# Altium project USV-Central Controller Board.PrjPcb (part 1 of 2)
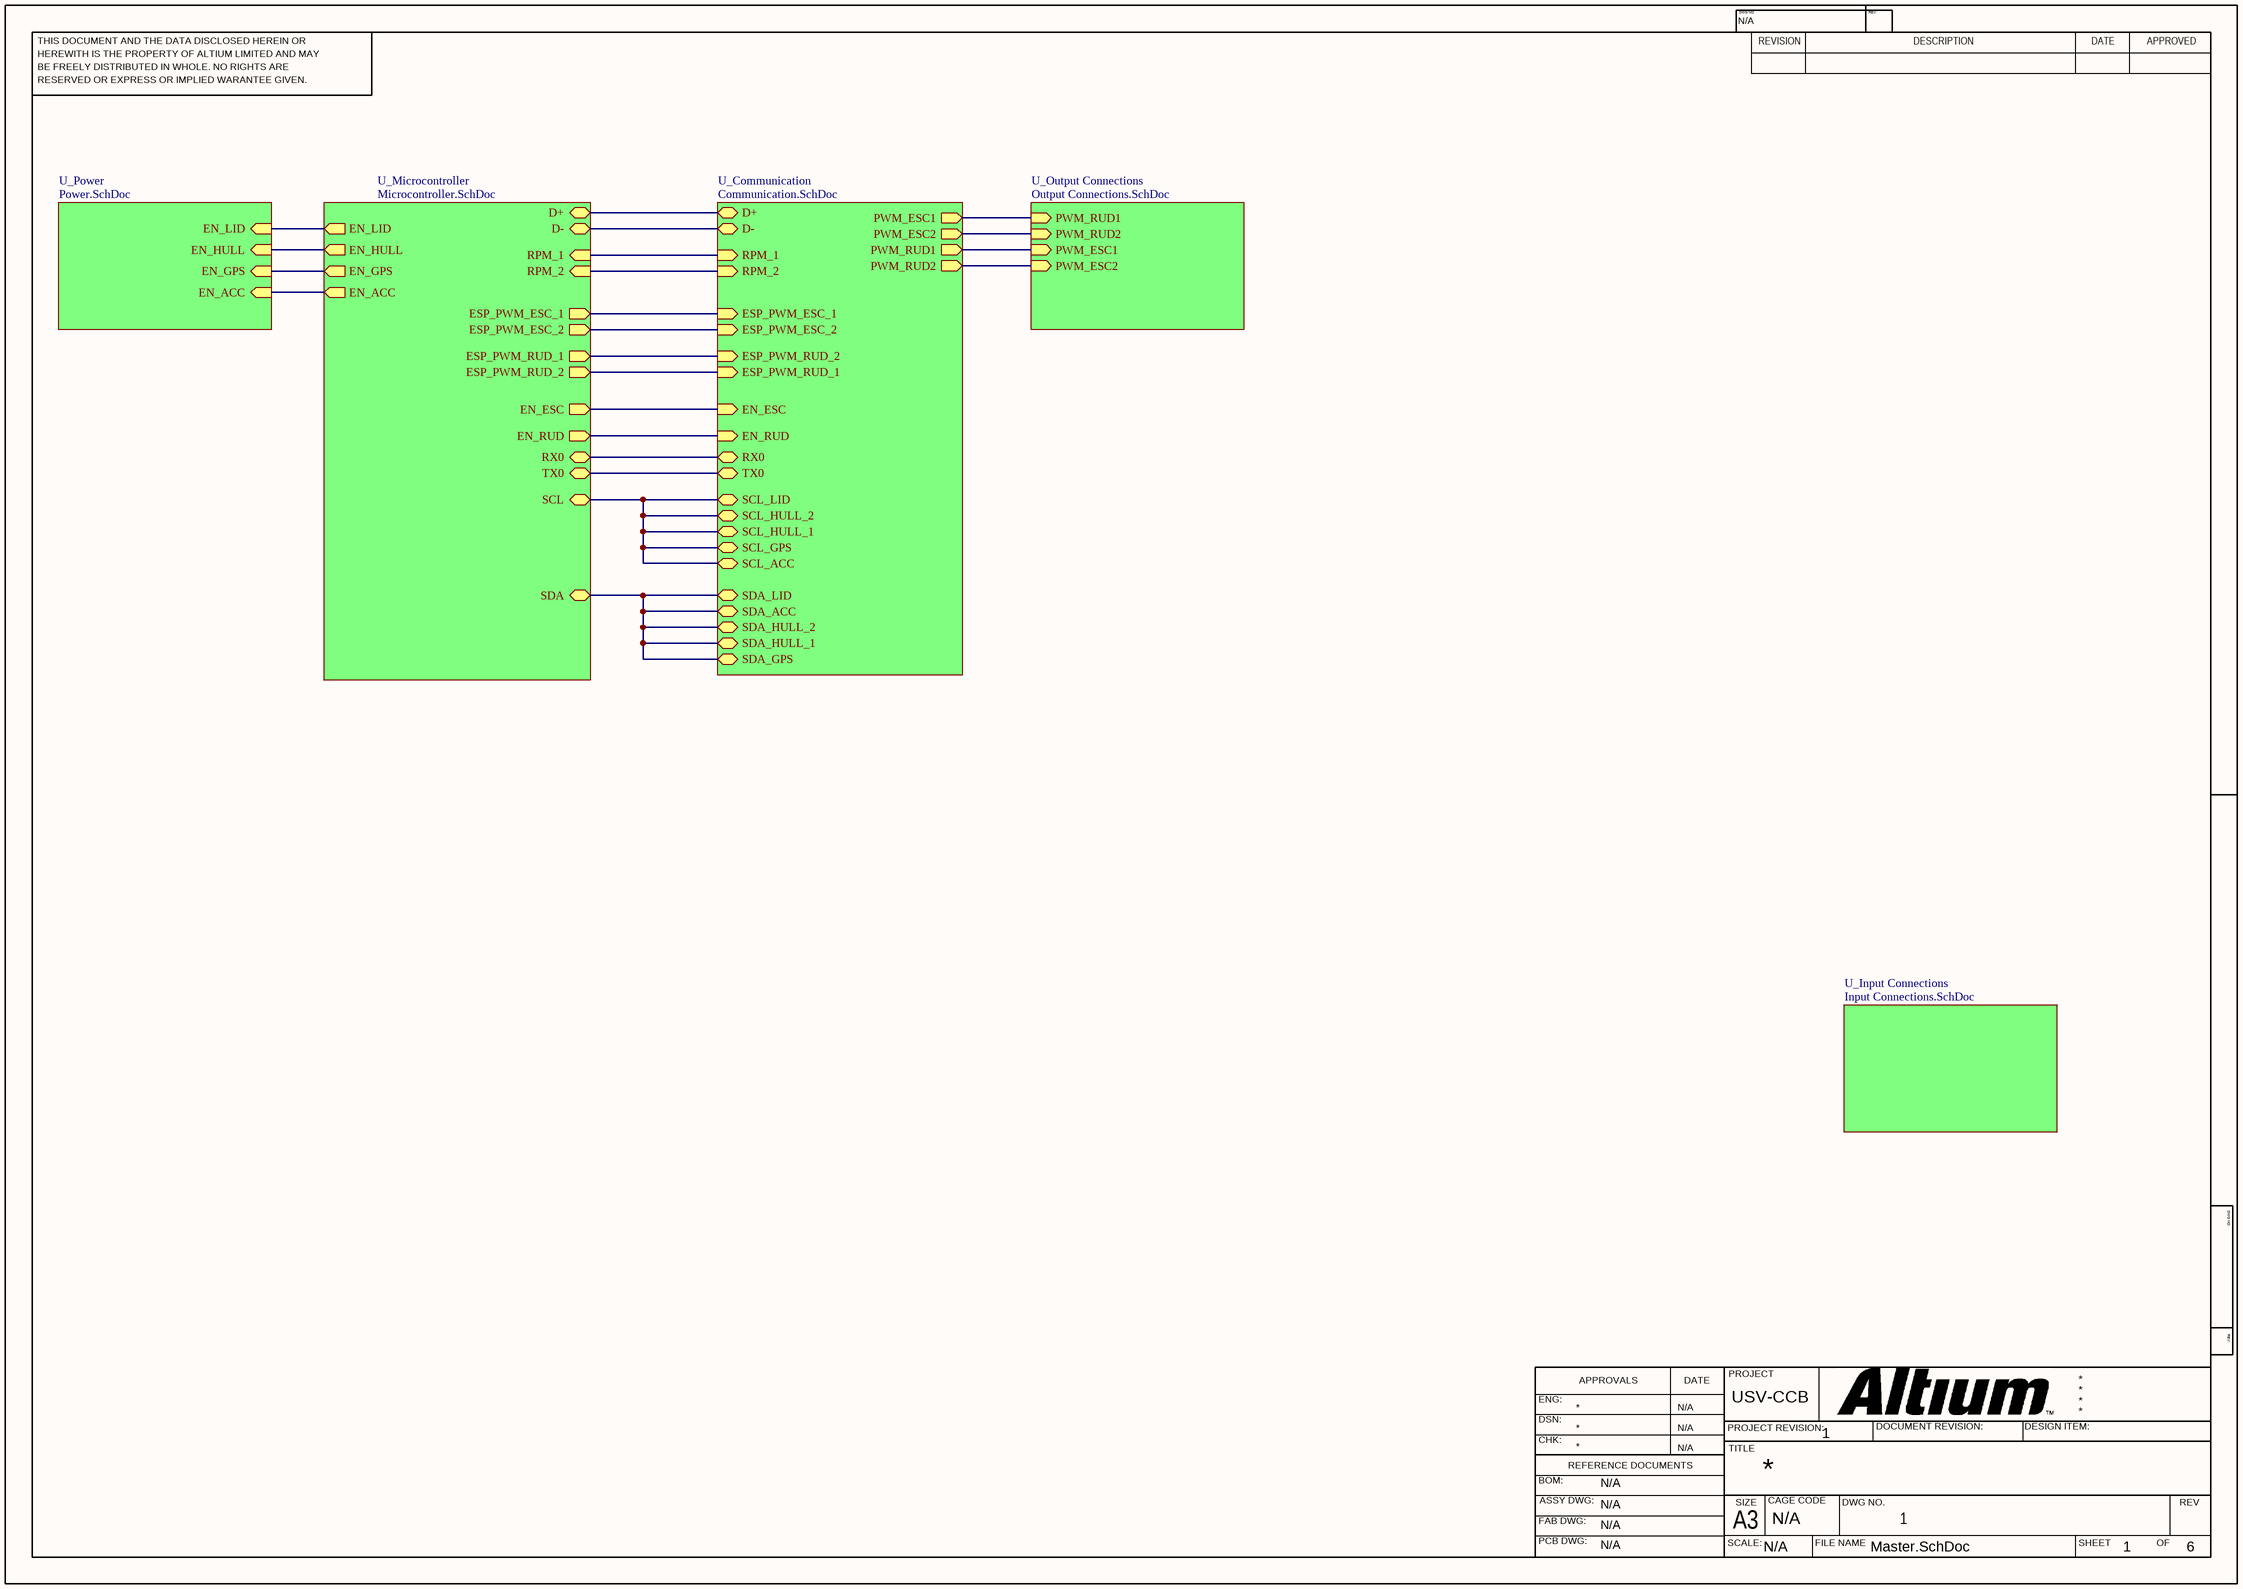
[diagram p0: Master.SchDoc]
CAGE_CODE: N/A; CHK_APP_DATE: N/A; DOC_NO_ASSY: 1; DOC_NO_ASSY_DWG: N/A; DOC_NO_BOM: N/A; DOC_NO_FAB_DWG: N/A; DOC_NO_SCH_DWG: 1; DSN_APP_DATE: N/A; ENG_APP_DATE: N/A; PCB_DWG_NO: N/A; Project: USV-CCB; SCH_SCALE: N/A; VersionControl_ProjFolderRevNumber: 1
6 sheets, 100 parts. Net scope: hierarchical (ports join the sheet entries above them; power ports are global).
Board file: USV-Central Controller Board.PcbDoc
Sheets:
  Master.SchDoc
    U_Power = Power.SchDoc
    U_Microcontroller = Microcontroller.SchDoc
    U_Input Connections = Input Connections.SchDoc
    U_Communication = Communication.SchDoc
    U_Output Connections = Output Connections.SchDoc

## Sheet Master.SchDoc
size 420 x 297 mm; SheetNumber: 1; SheetTotal: 6

### Sub-sheets
U_Communication = Communication.SchDoc: SDA_LID (bidir), RPM_1 (in), SCL_ACC (bidir), SDA_ACC (bidir), SCL_GPS (bidir), SDA_HULL_2 (bidir), SCL_HULL_2 (bidir), RPM_2 (in), SCL_HULL_1 (bidir), SDA_HULL_1 (bidir), SCL_LID (bidir), SDA_GPS (bidir), PWM_ESC1 (out), EN_ESC (in), ESP_PWM_ESC_1 (in), PWM_ESC2 (out), ESP_PWM_ESC_2 (in), PWM_RUD1 (out), ESP_PWM_RUD_1 (in), PWM_RUD2 (out), ESP_PWM_RUD_2 (in), EN_RUD (in), D+ (bidir), D- (bidir), RX0 (bidir), TX0 (bidir)
U_Input Connections = Input Connections.SchDoc: no entries
U_Microcontroller = Microcontroller.SchDoc: SDA (bidir), SCL (bidir), RPM_1 (in), RPM_2 (in), ESP_PWM_RUD_1 (out), ESP_PWM_RUD_2 (out), ESP_PWM_ESC_1 (out), ESP_PWM_ESC_2 (out), EN_LID (out), EN_HULL (out), EN_GPS (out), EN_ACC (out), EN_ESC (out), EN_RUD (out), D- (bidir), D+ (bidir), TX0 (bidir), RX0 (bidir)
U_Output Connections = Output Connections.SchDoc: PWM_RUD1 (in), PWM_RUD2 (in), PWM_ESC1 (in), PWM_ESC2 (in)
U_Power = Power.SchDoc: EN_LID (in), EN_HULL (in), EN_GPS (in), EN_ACC (in)

### Nets
D_N: sheet U_Microcontroller/D-, sheet U_Communication/D-
D_P: sheet U_Microcontroller/D+, sheet U_Communication/D+
RX0: sheet U_Microcontroller/RX0, sheet U_Communication/RX0
TX0: sheet U_Microcontroller/TX0, sheet U_Communication/TX0
NetC24_1: sheet U_Microcontroller/EN_RUD, sheet U_Communication/EN_RUD
NetC28_1: sheet U_Microcontroller/EN_ESC, sheet U_Communication/EN_ESC
NetJ2_2: sheet U_Communication/PWM_ESC1, sheet U_Output Connections/PWM_RUD1
NetJ3_2: sheet U_Communication/PWM_RUD1, sheet U_Output Connections/PWM_ESC1
NetJ4_2: sheet U_Communication/PWM_ESC2, sheet U_Output Connections/PWM_RUD2
NetJ5_2: sheet U_Communication/PWM_RUD2, sheet U_Output Connections/PWM_ESC2
NetK1_10: sheet U_Microcontroller/ESP_PWM_RUD_1, sheet U_Communication/ESP_PWM_RUD_2
NetK2_10: sheet U_Microcontroller/ESP_PWM_ESC_2, sheet U_Communication/ESP_PWM_ESC_2
NetK3_10: sheet U_Microcontroller/ESP_PWM_RUD_2, sheet U_Communication/ESP_PWM_RUD_1
NetK4_10: sheet U_Microcontroller/ESP_PWM_ESC_1, sheet U_Communication/ESP_PWM_ESC_1
NetMD1_10: sheet U_Power/EN_HULL, sheet U_Microcontroller/EN_HULL
NetMD1_11: sheet U_Power/EN_GPS, sheet U_Microcontroller/EN_GPS
NetMD1_12: sheet U_Power/EN_ACC, sheet U_Microcontroller/EN_ACC
NetMD1_24: sheet U_Microcontroller/RPM_1, sheet U_Communication/RPM_1
NetMD1_26: sheet U_Microcontroller/RPM_2, sheet U_Communication/RPM_2
NetMD1_33: sheet U_Microcontroller/SDA, sheet U_Communication/SDA_LID, sheet U_Communication/SDA_ACC, sheet U_Communication/SDA_HULL_2, sheet U_Communication/SDA_HULL_1, sheet U_Communication/SDA_GPS
NetMD1_36: sheet U_Microcontroller/SCL, sheet U_Communication/SCL_ACC, sheet U_Communication/SCL_GPS, sheet U_Communication/SCL_HULL_2, sheet U_Communication/SCL_HULL_1, sheet U_Communication/SCL_LID
NetMD1_37: sheet U_Power/EN_LID, sheet U_Microcontroller/EN_LID

### Notes on the sheet
- THIS DOCUMENT AND THE DATA DISCLOSED HEREIN OR
- HEREWITH IS THE PROPERTY OF ALTIUM LIMITED AND MAY
- DWG NO:
- REVISION
- REV:
- DESCRIPTION
- DATE
- APPROVED
- BE FREELY DISTRIBUTED IN WHOLE. NO RIGHTS ARE
- RESERVED OR EXPRESS OR IMPLIED WARANTEE GIVEN.
- ENG:
- APPROVALS
- PROJECT
- DSN:
- CHK:
- REFERENCE DOCUMENTS
- PROJECT REVISION:
- TITLE
- DOCUMENT REVISION:
- DESIGN ITEM:
- BOM:
- FAB DWG:
- PCB DWG:
- ASSY DWG:
- SCALE:
- A3
- SIZE
- CAGE CODE
- FILE NAME
- DWG NO.
- SHEET
- OF
- REV

## Sheet Power.SchDoc
size 420 x 297 mm; SheetNumber: 2; SheetTotal: 6; SPICEModelCacheKNAGYUHY: <root> / <DocumentId>KNAGYUHY</DocumentId> / </root>
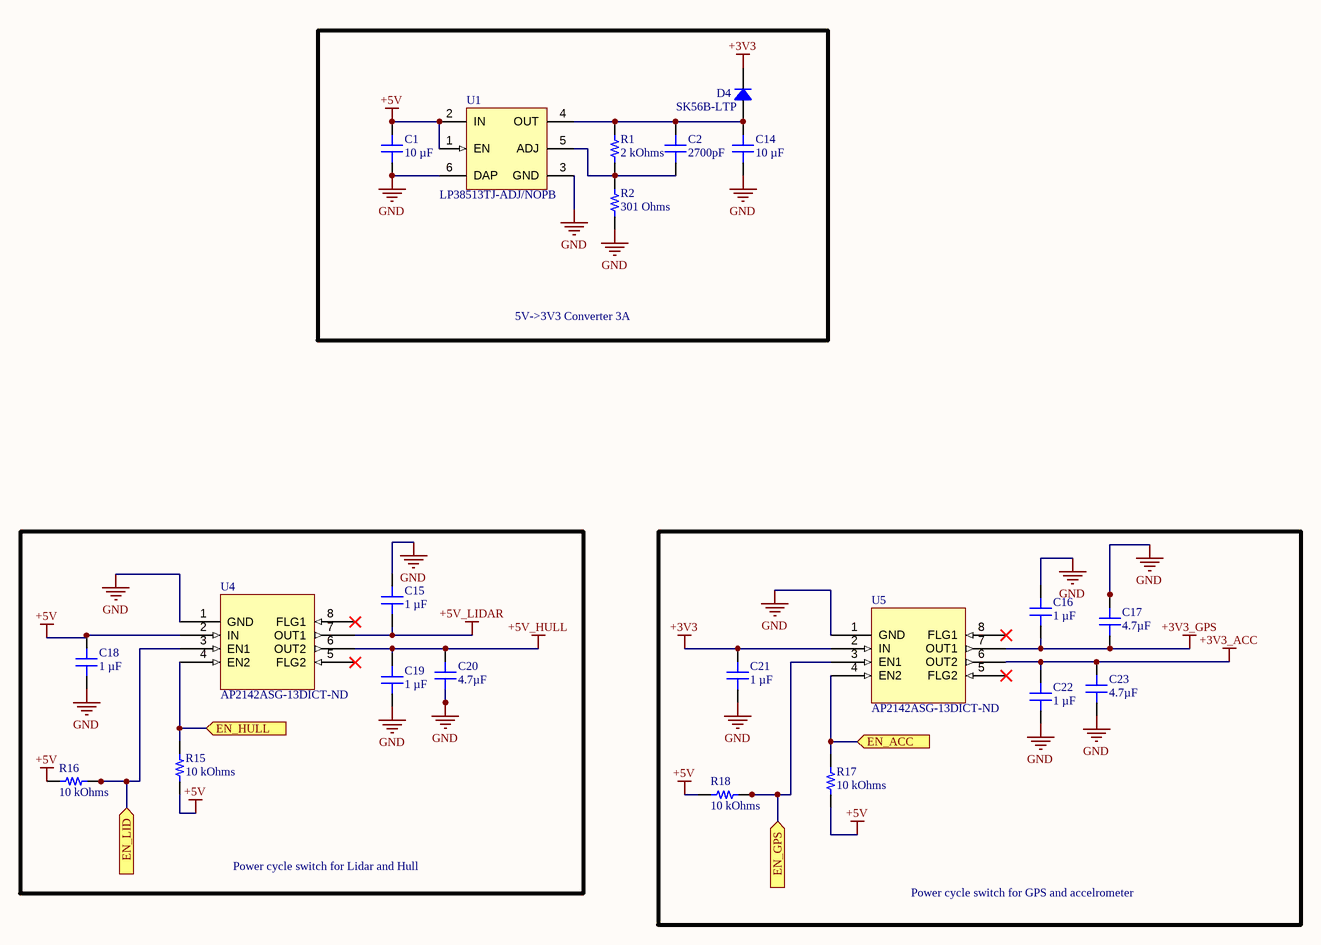
[diagram p1: Power.SchDoc]

### Parts
C1  10 µF  [CAP 0805_2012]
C2  2700pF  [CAP 0603_1608]
C14  10 µF  [CAP 0805_2012]
C15  1 µF  [CAP 0603_1608]
C16  1 µF  [CAP 0603_1608]
C17  4.7µF  [CAP 0805_2012]
C18  1 µF  [CAP 0603_1608]
C19  1 µF  [CAP 0603_1608]
C20  4.7µF  [CAP 0805_2012]
C21  1 µF  [CAP 0603_1608]
C22  1 µF  [CAP 0603_1608]
C23  4.7µF  [CAP 0805_2012]
D4  SK56B-LTP  [DO214AA SMB]
R1  2 kOhms  [RES 0603_1608]
R2  301 Ohms  [RES 0603_1608]
R15  10 kOhms  [RES 0603_1608]
R16  10 kOhms  [RES 0603_1608]
R17  10 kOhms  [RES 0603_1608]
R18  10 kOhms  [RES 0603_1608]
U1  LP38513TJ-ADJ/NOPB  [NDQ0005A_M]
U4  AP2142ASG-13DICT-ND  [SOP127P600X175-8N]
U5  AP2142ASG-13DICT-ND  [SOP127P600X175-8N]

### Blocks framed on the sheet
5V->3V3 Converter 3A: C1 C2 C14 D4 R1 R2 U1
Power cycle switch for Lidar and Hull: C15 C18-C20 R15 R16 U4
Power cycle switch for GPS and accelrometer: C16 C17 C21-C23 R17 R18 U5

### Ports
EN_ACC (in), EN_GPS (in), EN_HULL (in), EN_LID (in)

### Nets
+3V3: C21.1 D4.2 U5.2(IN)
+3V3_ACC: C22.2 C23.2 U5.6(OUT2)
+3V3_GPS: C16.1 C17.2 U5.7(OUT1)
+5V: C1.2 C18.1 R15.2 R16.2 R17.2 R18.2 U1.1(EN) U1.2(IN) U4.2(IN)
+5V_HULL: C19.2 C20.2 U4.6(OUT2)
+5V_LIDAR: C15.1 U4.7(OUT1)
GND: C1.1 C14.1 C15.2 C16.2 C17.1 C18.2 C19.1 C20.1 C21.2 C22.1 C23.1 R2.1 U1.3(GND) U1.6(DAP) U4.1(GND) U5.1(GND)
NetC2_1: C2.1 R1.1 R2.2 U1.5(ADJ)
NetC2_2: C2.2 C14.2 D4.1 R1.2 U1.4(OUT)
NetMD1_10: R15.1 U4.4(EN2) ; port EN_HULL
NetMD1_11: R18.1 U5.3(EN1) ; port EN_GPS
NetMD1_12: R17.1 U5.4(EN2) ; port EN_ACC
NetMD1_37: R16.1 U4.3(EN1) ; port EN_LID

Not connected (* = marked no-connect by the designer): U4 5(FLG2)* 8(FLG1)*; U5 5(FLG2)* 8(FLG1)*

### Notes on the sheet
- THIS DOCUMENT AND THE DATA DISCLOSED HEREIN OR
- HEREWITH IS THE PROPERTY OF ALTIUM LIMITED AND MAY
- DWG NO:
- REVISION
- REV:
- DESCRIPTION
- DATE
- APPROVED
- BE FREELY DISTRIBUTED IN WHOLE. NO RIGHTS ARE
- RESERVED OR EXPRESS OR IMPLIED WARANTEE GIVEN.
- ENG:
- APPROVALS
- PROJECT
- DSN:
- CHK:
- REFERENCE DOCUMENTS
- PROJECT REVISION:
- TITLE
- DOCUMENT REVISION:
- DESIGN ITEM:
- BOM:
- FAB DWG:
- PCB DWG:
- ASSY DWG:
- SCALE:
- A3
- SIZE
- CAGE CODE
- FILE NAME
- DWG NO.
- SHEET
- OF
- REV

### Library data of the parts
C1 C14 = CGA4J1X5R1C106K125AC: CAP CER 10UF 16V X5R 0805; manufacturer: TDK Corporation; Tolerance: ±10%; Part Number: CGA4J1X5R1C106K125AC; Value: 10 µF; Applications: Automotive; Capacitance: 10 µF; componentlink1description: Datasheet; componentlink1url: https://product.tdk.com/info/en/catalog/datasheets/mlcc_automotive_general_en.pdf?ref_disty=digikey; componentlink2description: DigiKey Link; componentlink2url: https://www.digikey.com/en/products/detail/tdk-corporation/CGA4J1X5R1C106K125AC/2781309; Device Package: 0805 (2012 Metric); lastupdated: 2022-04-02 5:58:40 AM; Lifecycle Status: Active; Minimum Order: 1; Mounting Type: Surface Mount, MLCC; Operating Temperature: -55°C ~ 85°C; Package / Case: 0805 (2012 Metric); packaging: TapeAndReel; partid: 3076; Part Status: Active; price: 0.09; Ratings: AEC-Q200; series: CGA; Size / Dimension: 0.079" L x 0.049" W (2.00mm x 1.25mm); Supplier 1: DigiKey; Supplier Part Number 1: 445-7883-1-ND; Temperature Coefficient: X5R; Thickness (Max): 0.057" (1.45mm); Voltage - Rated: 16V
C2 = 06035C272KAT2A: CAP CER 2700PF 50V X7R 0603; manufacturer: AVX Corporation; Tolerance: ±10%; Part Number: 06035C272KAT2A; Value: 2700pF; Applications: General Purpose; Capacitance: 2700pF; componentlink1description: Datasheet; componentlink1url: http://datasheets.avx.com/X7RDielectric.pdf; componentlink2description: DigiKey Link; componentlink2url: http://digikey.com/product-detail/en/avx-corporation/06035C272KAT2A/478-1220-1-ND/564252; Device Package: 0603 (1608 Metric); lastupdated: 2020-09-02 1:03:32 AM; Lifecycle Status: Active; Minimum Order: 1; Mounting Type: Surface Mount, MLCC; Operating Temperature: -55°C ~ 125°C; Package / Case: 0603 (1608 Metric); packaging: TapeAndReel; partid: 4337; Part Status: Active; price: 0.02; series: -; Size / Dimension: 0.063" L x 0.032" W (1.60mm x 0.81mm); Supplier 1: DigiKey; Supplier Part Number 1: 478-1220-1-ND; Temperature Coefficient: X7R; Thickness (Max): 0.035" (0.90mm); Voltage - Rated: 50V
C15 C16 C18 C19 C21 C22 = CM105X7R105K16ATH: CAP CER 1UF 16V X7R 0603; manufacturer: KYOCERA AVX; Tolerance: ±10%; Part Number: CM105X7R105K16ATH; Value: 1 µF; Applications: General Purpose; Capacitance: 1 µF; componentlink1description: Datasheet; componentlink1url: https://ele.kyocera.com/assets/products/capacitor/CM_Series_e.pdf; componentlink2description: DigiKey Link; componentlink2url: https://www.digikey.com/en/products/detail/kyocera-avx/CM105X7R105K16ATH/10197120; Device Package: 0603 (1608 Metric); lastupdated: 2022-03-07 3:17:15 PM; Lifecycle Status: Active; Minimum Order: 1; Mounting Type: Surface Mount, MLCC; Operating Temperature: -55°C ~ 125°C; Package / Case: 0603 (1608 Metric); packaging: TapeAndReel; partid: 34778; Part Status: Active; price: 0.03; series: CM; Size / Dimension: 0.063" L x 0.031" W (1.60mm x 0.80mm); Supplier 1: DigiKey; Supplier Part Number 1: 478-CM105X7R105K16ATHCT-ND; Temperature Coefficient: X7R; Thickness (Max): 0.035" (0.90mm); Voltage - Rated: 16V
C17 C20 C23 = 0805ZC475MAT2A: CAP CER 4.7UF 10V X7R 0805; manufacturer: AVX Corporation; Tolerance: ±20%; Part Number: 0805ZC475MAT2A; Value: 4.7µF; Applications: General Purpose; Capacitance: 4.7µF; componentlink1description: Datasheet; componentlink1url: http://datasheets.avx.com/X7RDielectric.pdf; componentlink2description: DigiKey Link; componentlink2url: http://digikey.com/product-detail/en/avx-corporation/0805ZC475MAT2A/478-7965-1-ND/3881588; Device Package: 0805 (2012 Metric); lastupdated: 2020-09-02 1:04:25 AM; Lifecycle Status: Active; Minimum Order: 1; Mounting Type: Surface Mount, MLCC; Operating Temperature: -55°C ~ 125°C; Package / Case: 0805 (2012 Metric); packaging: TapeAndReel; partid: 11941; Part Status: Active; price: 0.29; series: -; Size / Dimension: 0.079" L x 0.049" W (2.00mm x 1.25mm); Supplier 1: DigiKey; Supplier Part Number 1: 478-7965-1-ND; Temperature Coefficient: X7R; Thickness (Max): 0.060" (1.52mm); Voltage - Rated: 10V
D4 = SK56B-LTP: DIODE SCHOTTKY 60V 5A DO214AA; Manufacturer: Micro Commercial Co; Capacitance @ Vr, F: 200pF @ 4V, 1MHz; Current - Reverse Leakage @ Vr: 1 mA @ 60 V; Speed: Fast Recovery =< 500ns, > 200mA (Io); Voltage - Forward (Vf) (Max) @ If: 750 mV @ 5 A; Part Number: SK56B-LTP; ComponentLink1Description: Datasheet; ComponentLink1URL: https://www.mccsemi.com/pdf/Products/SK52B-L-SK520B-L(DO-214AA).pdf; ComponentLink2Description: DigiKey Link; ComponentLink2URL: https://www.digikey.com/en/products/detail/micro-commercial-co/SK56B-LTP/5865060; Current - Average Rectified (Io): 5A; Diode Type: Schottky; LastUpdated: 2022-03-07 3:54:27 PM; Lifecycle Status: Active; Minimum Order: 1; Mounting Type: Surface Mount; Operating Temperature - Junction: -55°C ~ 150°C; Package / Case: DO-214AA, SMB; Packaging: TapeAndReel; PartId: 1476; Part Status: Active; Price: 0.12; Series: -; Supplier 1: DigiKey; Supplier Part Number 1: SK56B-LTPMSCT-ND; Supplier Device Package: DO-214AA (SMB); Voltage - DC Reverse (Vr) (Max): 60 V
R1 = RMCF0603FT2K00: RES 2K OHM 1% 1/10W 0603; Manufacturer: Stackpole Electronics Inc; Power (Watts): 0.1W, 1/10W; Temperature Coefficient: ±100ppm/°C; Part Number: RMCF0603FT2K00; Value: 2 kOhms; ComponentLink1Description: Datasheet; ComponentLink1URL: https://www.seielect.com/catalog/sei-rmcf_rmcp.pdf; ComponentLink2Description: DigiKey Link; ComponentLink2URL: https://www.digikey.com/en/products/detail/stackpole-electronics-inc/RMCF0603FT2K00/1761334; Composition: Thick Film; Device Package: 0603 (1608 Metric); Features: Automotive AEC-Q200; Height - Seated (Max): 0.022" (0.55mm); LastUpdated: 2022-04-02 6:14:17 AM; Lifecycle Status: Active; Minimum Order: 1; Number of Terminations: 2; Operating Temperature: -55°C ~ 155°C; Package / Case: 0603 (1608 Metric); Packaging: CutTape; PartId: 6085; Part Status: Active; Price: 0.01; Ratings: AEC-Q200; Resistance: 2 kOhms; Series: RMCF; Size / Dimension: 0.061" L x 0.031" W (1.55mm x 0.80mm); Supplier 1: DigiKey; Supplier Part Number 1: RMCF0603FT2K00CT-ND; Supplier Device Package: 0603; Tolerance: ±1%
R2 = RMCF0603FT301R: RES 301 OHM 1% 1/10W 0603; Manufacturer: Stackpole Electronics Inc; Power (Watts): 0.1W, 1/10W; Temperature Coefficient: ±100ppm/°C; Part Number: RMCF0603FT301R; Value: 301 Ohms; ComponentLink1Description: Datasheet; ComponentLink1URL: https://www.seielect.com/catalog/sei-rmcf_rmcp.pdf; ComponentLink2Description: DigiKey Link; ComponentLink2URL: https://www.digikey.com/en/products/detail/stackpole-electronics-inc/RMCF0603FT301R/1760800; Composition: Thick Film; Device Package: 0603 (1608 Metric); Features: Automotive AEC-Q200; Height - Seated (Max): 0.022" (0.55mm); LastUpdated: 2022-09-19 1:22:12 PM; Lifecycle Status: Active; Minimum Order: 1; Number of Terminations: 2; Operating Temperature: -55°C ~ 155°C; Package / Case: 0603 (1608 Metric); Packaging: CutTape; PartId: 10665; Part Status: Active; Price: 0.01; Ratings: AEC-Q200; Resistance: 301 Ohms; Series: RMCF; Size / Dimension: 0.061" L x 0.031" W (1.55mm x 0.80mm); Supplier 1: DigiKey; Supplier Part Number 1: RMCF0603FT301RCT-ND; Supplier Device Package: 0603; Tolerance: ±1%
R15-R18 = RT0603FRE0710KL: RES SMD 10K OHM 1% 1/10W 0603; Manufacturer: Yageo; Power (Watts): 0.1W, 1/10W; Temperature Coefficient: ±50ppm/°C; Part Number: RT0603FRE0710KL; Value: 10 kOhms; ComponentLink1Description: Datasheet; ComponentLink1URL: https://www.yageo.com/upload/media/product/productsearch/datasheet/rchip/PYu-RT_1-to-0.01_RoHS_L_11.pdf; ComponentLink2Description: DigiKey Link; ComponentLink2URL: http://digikey.com/product-detail/en/yageo/RT0603FRE0710KL/YAG2321CT-ND/5252435; Composition: Thin Film; Device Package: 0603 (1608 Metric); Height - Seated (Max): 0.022" (0.55mm); LastUpdated: 2022-03-07 3:35:56 PM; Lifecycle Status: Active; Minimum Order: 1; Number of Terminations: 2; Operating Temperature: -55°C ~ 155°C; Package / Case: 0603 (1608 Metric); Packaging: TapeAndReel; PartId: 5671; Part Status: Active; Price: 0.01; Resistance: 10 kOhms; Series: RT; Size / Dimension: 0.063" L x 0.031" W (1.60mm x 0.80mm); Supplier 1: DigiKey; Supplier Part Number 1: YAG2321CT-ND; Supplier Device Package: 0603; Tolerance: ±1%
U1 = CMP-0062-00087-3: 3A Fast-Transient Response Adjustable Low-Dropout Linear Voltage Regulator, 5-pin TO-263 Thin, Pb-Free; Manufacturer: Texas Instruments; CompType: LDO IC; PowerWise: N; PackageTopMarking: NSUZXYTTE#*LP38513*TJ-ADJ; PackageDescription: Thin TO-263, Molded, 9.85 x 10.16 x 2mm Body, 5 Lead, 1.7mm Pitch, Surface Mount; ComponentLink1Description: Datasheet URL; PackageReference: NDQ0005A; ComponentLink1URL: http://www.ti.com/general/docs/lit/getliterature.tsp?genericPartNumber=LP38513-ADJ&fileType=pdf; PinCount: 5; RoHS: Y
U4 U5 = CMP-00033-7: AP2142A Series 5.5 V 0.5 A Dual Channel Current-Limited Power Switch - SOIC-8; Max Output Current: 500mA; Output Configuration: High Side; Number of Outputs: 2; Max Supply Voltage: 5.5V; On-State Resistance: 130mR; Min Supply Voltage: 2.7V; Interface: On/Off; Fault Protection: Over Temperature,Reverse Current; Weight: 0.00261oz; Min Operating Temperature: -40°C; RoHS Compliant: Yes; Series: -; Number of Pins: 8; Number of Switches: 2; Packaging: Tape and Reel; Max Operating Temperature: 85°C; Case/Package: SO; Package Quantity: 2500; Mount: Surface Mount; Radiation Hardening: No; REACH SVHC: No SVHC

## Sheet Microcontroller.SchDoc
size 420 x 297 mm; SheetNumber: 5; SheetTotal: 6
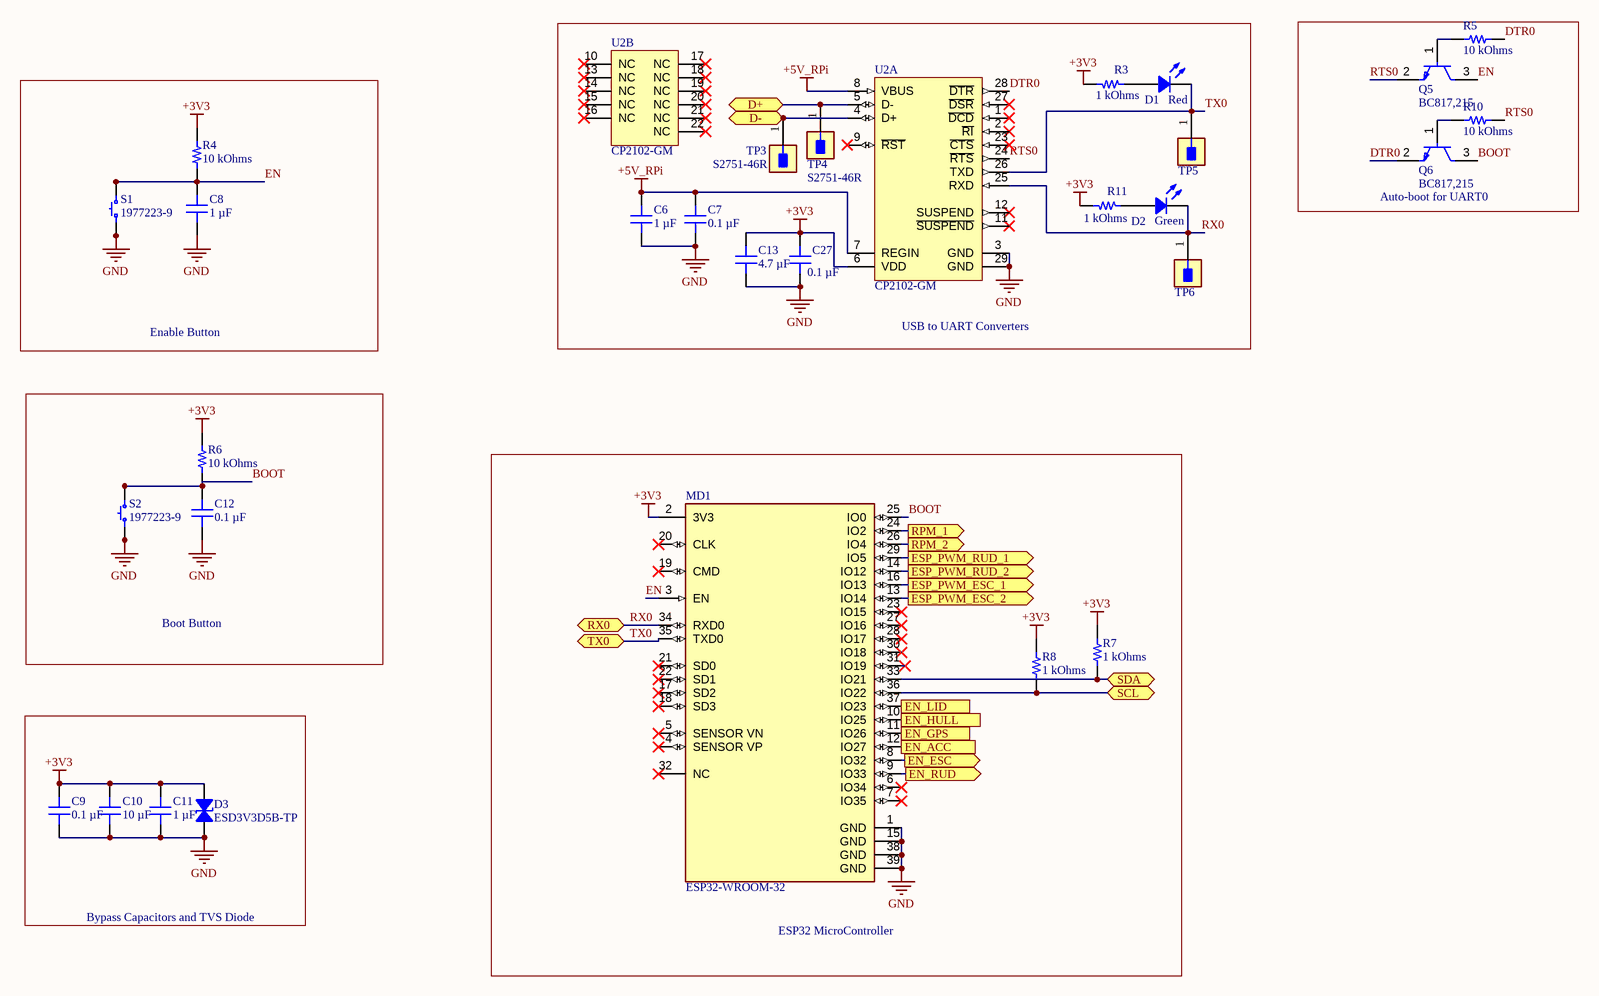
[diagram p2: Microcontroller.SchDoc]

### Parts
C6  1 µF  [CAP 0603_1608]
C7  0.1 µF  [CAP 0603_1608]
C8  1 µF  [CAP 0603_1608]
C9  0.1 µF  [CAP 0603_1608]
C10  10 µF  [CAP 0603_1608]
C11  1 µF  [CAP 0603_1608]
C12  0.1 µF  [CAP 0603_1608]
C13  4.7 µF  [CAP 0603_1608]
C27  0.1 µF  [CAP 0603_1608]
D1  Red  [LED 0805_2012 RED]
D2  Green  [LED 0805_2012 GREEN]
D3  ESD3V3D5B-TP  [SOD523F]
MD1  ESP32-WROOM-32  [FP-ESP32-WROOM-32-MFG]
Q5  BC817,215  [FP-SOT23-IPC_C]
Q6  BC817,215  [FP-SOT23-IPC_C]
R3  1 kOhms  [RES 0603_1608]
R4  10 kOhms  [RES 0603_1608]
R5  10 kOhms  [RES 0603_1608]
R6  10 kOhms  [RES 0603_1608]
R7  1 kOhms  [RES 0603_1608]
R8  1 kOhms  [RES 0603_1608]
R10  10 kOhms  [RES 0603_1608]
R11  1 kOhms  [RES 0603_1608]
S1  1977223-9  [TE FSM4JSMA]
S2  1977223-9  [TE FSM4JSMA]
TP3  S2751-46R  [FP-S2751-46R-MFG]
TP4  S2751-46R  [FP-S2751-46R-MFG]
TP5  S2751-46R  [FP-S2751-46R-MFG]  (value not drawn)
TP6  S2751-46R  [FP-S2751-46R-MFG]  (value not drawn)
U2  CP2102-GM  [SLAB-QFN-28-3125x3125TP_N]  (parts A,B of 2)

### Blocks framed on the sheet
USB to UART Converters: C6 C7 C13 C27 D1 D2 R3 R11 TP3-TP6 U2
Auto-boot for UART0: Q5 Q6 R5 R10
Enable Button: C8 R4 S1
Boot Button: C12 R6 S2
ESP32 MicroController: MD1 R7 R8
Bypass Capacitors and TVS Diode: C9-C11 D3

### Ports
D+ (bidir), D- (bidir), EN_ACC (out), EN_ESC (out), EN_GPS (out), EN_HULL (out), EN_LID (out), EN_RUD (out), ESP_PWM_ESC_1 (out), ESP_PWM_ESC_2 (out), ESP_PWM_RUD_1 (out), ESP_PWM_RUD_2 (out), RPM_1 (out), RPM_2 (out), RX0 (bidir), SCL (bidir), SDA (bidir), TX0 (bidir)

### Nets
+3V3: C9.2 C10.2 C11.2 C13.2 C27.2 D3.2 MD1.2(3V3) R3.2 R4.2 R6.2 R7.2 R8.2 R11.2 U2.6(VDD)
+5V_RPi: C6.2 C7.2 U2.7(REGIN) U2.8(VBUS)
GND: C6.1 C7.1 C8.1 C9.1 C10.1 C11.1 C12.1 C13.1 C27.1 D3.1 MD1.1(GND) MD1.15(GND) MD1.38(GND) MD1.39(GND) S1.1 S1.2 S2.1 S2.2 U2.3(GND) U2.29(GND)
BOOT: C12.2 MD1.25(IO0) Q6.3(C) R6.1 S2.3 S2.4
D_N: TP3.1 U2.4(D+) ; port D-
D_P: TP4.1 U2.5(D-) ; port D+
DTR0: Q6.2(E) R5.2 U2.28(~{DTR})
EN: C8.2 MD1.3(EN) Q5.3(C) R4.1 S1.3 S1.4
RTS0: Q5.2(E) R10.2 U2.24(~{RTS})
RX0: D2.2 MD1.34(RXD0) TP6.1 U2.25(RXD) ; port RX0
TX0: D1.2 MD1.35(TXD0) TP5.1 U2.26(TXD) ; port TX0
NetC24_1: MD1.9(IO33) ; port EN_RUD
NetC28_1: MD1.8(IO32) ; port EN_ESC
NetD1_1: D1.1 R3.1
NetD2_1: D2.1 R11.1
NetK1_10: MD1.29(IO5) ; port ESP_PWM_RUD_1
NetK2_10: MD1.13(IO14) ; port ESP_PWM_ESC_2
NetK3_10: MD1.14(IO12) ; port ESP_PWM_RUD_2
NetK4_10: MD1.16(IO13) ; port ESP_PWM_ESC_1
NetMD1_10: MD1.10(IO25) ; port EN_HULL
NetMD1_11: MD1.11(IO26) ; port EN_GPS
NetMD1_12: MD1.12(IO27) ; port EN_ACC
NetMD1_24: MD1.24(IO2) ; port RPM_1
NetMD1_26: MD1.26(IO4) ; port RPM_2
NetMD1_33: MD1.33(IO21) R7.1 ; port SDA
NetMD1_36: MD1.36(IO22) R8.1 ; port SCL
NetMD1_37: MD1.37(IO23) ; port EN_LID
NetQ5_1: Q5.1(B) R5.1
NetQ6_1: Q6.1(B) R10.1

Not connected (* = marked no-connect by the designer): MD1 4(SENSOR_VP)* 5(SENSOR_VN)* 6(IO34)* 7(IO35)* 17(SD2)* 18(SD3)* 19(CMD)* 20(CLK)* 21(SD0)* 22(SD1)* 23(IO15)* 27(IO16)* 28(IO17)* 30(IO18)* 31(IO19)* 32(NC)*; U2 1(~{DCD})* 2(~{RI})* 9(~{RST})* 10(NC)* 11(~{SUSPEND})* 12(SUSPEND)* 13(NC)* 14(NC)* 15(NC)* 16(NC)* 17(NC)* 18(NC)* 19(NC)* 20(NC)* 21(NC)* 22(NC)* 23(~{CTS})* 27(~{DSR})*

### Notes on the sheet
- THIS DOCUMENT AND THE DATA DISCLOSED HEREIN OR
- HEREWITH IS THE PROPERTY OF ALTIUM LIMITED AND MAY
- DWG NO:
- REVISION
- REV:
- DESCRIPTION
- DATE
- APPROVED
- BE FREELY DISTRIBUTED IN WHOLE. NO RIGHTS ARE
- RESERVED OR EXPRESS OR IMPLIED WARANTEE GIVEN.
- ENG:
- APPROVALS
- PROJECT
- DSN:
- CHK:
- REFERENCE DOCUMENTS
- PROJECT REVISION:
- TITLE
- DOCUMENT REVISION:
- DESIGN ITEM:
- BOM:
- FAB DWG:
- PCB DWG:
- ASSY DWG:
- SCALE:
- A3
- SIZE
- CAGE CODE
- FILE NAME
- DWG NO.
- SHEET
- OF
- REV

### Library data of the parts
C6 = GRT188C8YA105KE13D: CAP CER 1UF 35V X6S 0603; manufacturer: Murata Electronics; Tolerance: ±10%; Part Number: GRT188C8YA105KE13D; Value: 1 µF; Applications: Automotive; Capacitance: 1 µF; componentlink1description: Datasheet; componentlink1url: https://search.murata.co.jp/Ceramy/image/img/A01X/G101/ENG/GRT188C8YA105KE13-01.pdf; componentlink2description: DigiKey Link; componentlink2url: https://www.digikey.com/en/products/detail/murata-electronics/GRT188C8YA105KE13D/5416719; Device Package: 0603 (1608 Metric); lastupdated: 2022-09-19 1:01:07 PM; Lifecycle Status: Active; Minimum Order: 1; Mounting Type: Surface Mount, MLCC; Operating Temperature: -55°C ~ 105°C; Package / Case: 0603 (1608 Metric); packaging: TapeAndReel; partid: 6736; Part Status: Active; price: 0.03; Ratings: AEC-Q200; series: GRT; Size / Dimension: 0.063" L x 0.031" W (1.60mm x 0.80mm); Supplier 1: DigiKey; Supplier Part Number 1: 490-12297-1-ND; Temperature Coefficient: X6S; Thickness (Max): 0.035" (0.90mm); Voltage - Rated: 35V
C7 C9 C12 C27 = C0603X104M3RAC7867: CAP CER 0.1UF 25V X7R 0603; manufacturer: KEMET; Tolerance: ±20%; Part Number: C0603X104M3RAC7867; Value: 0.1 µF; Applications: Boardflex Sensitive; Capacitance: 0.1 µF; componentlink1description: Datasheet; componentlink1url: https://api.kemet.com/component-edge/download/datasheet/C0603X104M3RACTU.pdf; componentlink2description: DigiKey Link; componentlink2url: https://www.digikey.com/en/products/detail/kemet/C0603X104M3RAC7867/2202613; Device Package: 0603 (1608 Metric); Features: Soft Termination; lastupdated: 2022-03-07 3:18:24 PM; Lifecycle Status: Active; Minimum Order: 1; Mounting Type: Surface Mount, MLCC; Operating Temperature: -55°C ~ 125°C; Package / Case: 0603 (1608 Metric); packaging: TapeAndReel; partid: 2484; Part Status: Active; price: 0.07; series: SMD Comm X7R Flex; Size / Dimension: 0.063" L x 0.031" W (1.60mm x 0.80mm); Supplier 1: DigiKey; Supplier Part Number 1: 399-13148-1-ND; Temperature Coefficient: X7R; Thickness (Max): 0.034" (0.87mm); Voltage - Rated: 25V
C8 C11 = CM105X7R105K16ATH: as C15 on sheet Power; Part Number: CM105X7R105K16ATH; Value: 1 µF; Applications: General Purpose; Capacitance: 1 µF; componentlink1description: Datasheet; componentlink1url: https://ele.kyocera.com/assets/products/capacitor/CM_Series_e.pdf; componentlink2description: DigiKey Link; componentlink2url: https://www.digikey.com/en/products/detail/kyocera-avx/CM105X7R105K16ATH/10197120; Device Package: 0603 (1608 Metric); lastupdated: 2022-03-07 3:17:15 PM; Lifecycle Status: Active; Minimum Order: 1; Mounting Type: Surface Mount, MLCC; Operating Temperature: -55°C ~ 125°C; Package / Case: 0603 (1608 Metric); packaging: TapeAndReel; partid: 34778; Part Status: Active; price: 0.03; series: CM; Size / Dimension: 0.063" L x 0.031" W (1.60mm x 0.80mm); Supplier 1: DigiKey; Supplier Part Number 1: 478-CM105X7R105K16ATHCT-ND; Temperature Coefficient: X7R; Thickness (Max): 0.035" (0.90mm); Voltage - Rated: 16V
C10 = GRT188R61C106ME13D: CAP CER 10UF 16V X5R 0603; manufacturer: Murata Electronics; Tolerance: ±20%; Part Number: GRT188R61C106ME13D; Value: 10 µF; Applications: Automotive; Capacitance: 10 µF; componentlink1description: Datasheet; componentlink1url: https://search.murata.co.jp/Ceramy/image/img/A01X/G101/ENG/GRT188R61C106ME13-01.pdf; componentlink2description: DigiKey Link; componentlink2url: https://www.digikey.com/en/products/detail/murata-electronics/GRT188R61C106ME13D/5416740; Device Package: 0603 (1608 Metric); lastupdated: 2022-03-07 3:18:24 PM; Lifecycle Status: Active; Minimum Order: 1; Mounting Type: Surface Mount, MLCC; Operating Temperature: -55°C ~ 85°C; Package / Case: 0603 (1608 Metric); packaging: TapeAndReel; partid: 2515; Part Status: Active; price: 0.07; Ratings: AEC-Q200; series: GRT; Size / Dimension: 0.063" L x 0.031" W (1.60mm x 0.80mm); Supplier 1: DigiKey; Supplier Part Number 1: 490-12318-1-ND; Temperature Coefficient: X5R; Thickness (Max): 0.035" (0.90mm); Voltage - Rated: 16V
C13 = GRT188C81E475KE13D: CAP CER 4.7UF 25V X6S 0603; manufacturer: Murata Electronics; Tolerance: ±10%; Part Number: GRT188C81E475KE13D; Value: 4.7 µF; Applications: Automotive; Capacitance: 4.7 µF; componentlink1description: Datasheet; componentlink1url: https://search.murata.co.jp/Ceramy/image/img/A01X/G101/ENG/GRT188C81E475KE13-01.pdf; componentlink2description: DigiKey Link; componentlink2url: https://www.digikey.com/en/products/detail/murata-electronics/GRT188C81E475KE13D/5416717; Device Package: 0603 (1608 Metric); lastupdated: 2022-09-19 1:00:59 PM; Lifecycle Status: Active; Minimum Order: 1; Mounting Type: Surface Mount, MLCC; Operating Temperature: -55°C ~ 105°C; Package / Case: 0603 (1608 Metric); packaging: TapeAndReel; partid: 9729; Part Status: Active; price: 0.05; Ratings: AEC-Q200; series: GRT; Size / Dimension: 0.063" L x 0.031" W (1.60mm x 0.80mm); Supplier 1: DigiKey; Supplier Part Number 1: 490-12295-1-ND; Temperature Coefficient: X6S; Thickness (Max): 0.039" (1.00mm); Voltage - Rated: 25V
D1 = XZUR54W-1: LED RED CLEAR CHIP SMD; Manufacturer: SunLED; Configuration: Standard; Current - Test: 20mA; Lens Color: Colorless; Lens Size: 1.20mm x 1.25mm; Lens Style: Rectangle with Flat Top; Millicandela Rating: 7mcd; Viewing Angle: 120°; Voltage - Forward (Vf) (Typ): 2V; Wavelength - Dominant: 617nm; Wavelength - Peak: 627nm; Part Number: XZUR54W-1; Color: Red; ComponentLink1Description: Datasheet; ComponentLink1URL: https://www.sunledusa.com/products/spec/XZUR54W-1.pdf; ComponentLink2Description: DigiKey Link; ComponentLink2URL: https://www.digikey.com/en/products/detail/sunled/XZUR54W-1/4745810; Device Package: 0805 (2012 Metric); Height (Max): 0.75mm; LastUpdated: 2022-03-07 3:58:09 PM; Lens Transparency: Clear; Lifecycle Status: Active; Minimum Order: 1; Mounting Type: Surface Mount; Package / Case: 0805 (2012 Metric); Packaging: TapeAndReel; PartId: 362; Part Status: Active; Price: 0.05; Series: -; Size / Dimension: 2.00mm L x 1.25mm W; Supplier 1: DigiKey; Supplier Part Number 1: 1497-1208-1-ND; Supplier Device Package: Chip LED; Value: Red
D2 = XZVG54W-1: LED GREEN CLEAR CHIP SMD; Manufacturer: SunLED; Configuration: Standard; Current - Test: 20mA; Lens Color: Colorless; Lens Size: 1.20mm x 1.25mm; Lens Style: Rectangle with Flat Top; Millicandela Rating: 49mcd; Viewing Angle: 120°; Voltage - Forward (Vf) (Typ): 2.1V; Wavelength - Dominant: 570nm; Wavelength - Peak: 574nm; Part Number: XZVG54W-1; Color: Green; ComponentLink1Description: Datasheet; ComponentLink1URL: https://www.sunledusa.com/products/spec/XZVG54W-1.pdf; ComponentLink2Description: DigiKey Link; ComponentLink2URL: https://www.digikey.com/en/products/detail/sunled/XZVG54W-1/4745972; Device Package: 0805 (2012 Metric); Height (Max): 0.85mm; LastUpdated: 2022-03-07 3:58:15 PM; Lens Transparency: Clear; Lifecycle Status: Active; Minimum Order: 1; Mounting Type: Surface Mount; Package / Case: 0805 (2012 Metric); Packaging: TapeAndReel; PartId: 267; Part Status: Active; Price: 0.05; Series: -; Size / Dimension: 2.00mm L x 1.25mm W; Supplier 1: DigiKey; Supplier Part Number 1: 1497-1216-1-ND; Supplier Device Package: Chip LED; Value: Green
D3 = ESD3V3D5B-TP: TVS DIODE 3.3VWM 12VC SOD523; Manufacturer: Micro Commercial Co; Bidirectional Channels: 1; Capacitance @ Frequency: 16pF @ 1MHz; Current - Peak Pulse (10/1000µs): 8A (8/20µs); Power Line Protection: No; Power - Peak Pulse: 96W; Type: Zener; Voltage - Breakdown (Min): 4.2V; Voltage - Clamping (Max) @ Ipp: 12V; Voltage - Reverse Standoff (Typ): 3.3V (Max); Part Number: ESD3V3D5B-TP; Applications: General Purpose; ComponentLink1Description: Datasheet; ComponentLink1URL: https://www.mccsemi.com/pdf/Products/ESD3V3D5B(SOD-523)-A.pdf; ComponentLink2Description: DigiKey Link; ComponentLink2URL: https://www.digikey.com/en/products/detail/micro-commercial-co/ESD3V3D5B-TP/7681821; LastUpdated: 2022-03-07 4:10:21 PM; Lifecycle Status: Active; Minimum Order: 1; Mounting Type: Surface Mount; Operating Temperature: -55°C ~ 125°C (TJ); Package / Case: SC-79, SOD-523; Packaging: TapeAndReel; PartId: 9815; Part Status: Active; Price: 0.09; Series: -; Supplier 1: DigiKey; Supplier Part Number 1: ESD3V3D5B-TPMSCT-ND; Supplier Device Package: SOD-523
MD1 = CMP-194065-000008-1: RX TXRX MOD WIFI SURFACE MOUNT; Frequency: 2.5GHz; Sensitivity: -98dBm; Operating Supply Voltage: 3.6V; Data Rate: 150Mbps; Weight: 0.088185oz; Package Quantity: 550; Min Operating Temperature: -40°C; Mount: Surface Mount; Max Operating Temperature: 85°C; Packaging: Cut Tape; Case/Package: SMD/SMT
Q5 Q6 = CMP-14406-000041-1: TRANS NPN 45V 500MA TO236AB; RoHS Compliant: Yes
R3 R7 R8 R11 = CRCW06031K00FKEB: RES SMD 1K OHM 1% 1/10W 0603; Manufacturer: Vishay Dale; Power (Watts): 0.1W, 1/10W; Temperature Coefficient: ±100ppm/°C; Part Number: CRCW06031K00FKEB; Value: 1 kOhms; ComponentLink1Description: Datasheet; ComponentLink1URL: http://www.vishay.com/docs/20035/dcrcwe3.pdf; ComponentLink2Description: DigiKey Link; ComponentLink2URL: http://digikey.com/product-detail/en/vishay-dale/CRCW06031K00FKEB/541-2985-1-ND/6073628; Composition: Thick Film; Device Package: 0603 (1608 Metric); Features: Automotive AEC-Q200; Height - Seated (Max): 0.020" (0.50mm); Lifecycle Status: Active; Minimum Order: 1; Number of Terminations: 2; Operating Temperature: -55°C ~ 155°C; Package / Case: 0603 (1608 Metric); Packaging: CutTape; PartId: 5123; Part Status: Active; Price: 0.10; Ratings: AEC-Q200; Resistance: 1 kOhms; Series: CRCW; Size / Dimension: 0.063" L x 0.033" W (1.60mm x 0.85mm); Supplier 1: DigiKey; Supplier Part Number 1: 541-2985-1-ND; Supplier Device Package: 0603; Tolerance: ±1%
  R3 R11: LastUpdated: 2022-03-07 3:35:57 PM
  R7 R8: LastUpdated: 2022-03-31 9:04:57 AM
R4 R6 = RT0603FRE0710KL: as R15 on sheet Power; Part Number: RT0603FRE0710KL; Value: 10 kOhms; ComponentLink1Description: Datasheet; ComponentLink1URL: https://www.yageo.com/upload/media/product/productsearch/datasheet/rchip/PYu-RT_1-to-0.01_RoHS_L_11.pdf; ComponentLink2Description: DigiKey Link; ComponentLink2URL: http://digikey.com/product-detail/en/yageo/RT0603FRE0710KL/YAG2321CT-ND/5252435; Composition: Thin Film; Device Package: 0603 (1608 Metric); Height - Seated (Max): 0.022" (0.55mm); LastUpdated: 2022-03-07 3:35:56 PM; Lifecycle Status: Active; Minimum Order: 1; Number of Terminations: 2; Operating Temperature: -55°C ~ 155°C; Package / Case: 0603 (1608 Metric); Packaging: TapeAndReel; PartId: 5671; Part Status: Active; Price: 0.01; Resistance: 10 kOhms; Series: RT; Size / Dimension: 0.063" L x 0.031" W (1.60mm x 0.80mm); Supplier 1: DigiKey; Supplier Part Number 1: YAG2321CT-ND; Supplier Device Package: 0603; Tolerance: ±1%
R5 R10 = RC0603FR-7W10KL: RES 10K OHM 1% 1/5W 0603; Manufacturer: Yageo; Power (Watts): 0.2W, 1/5W; Temperature Coefficient: ±200ppm/°C; Part Number: RC0603FR-7W10KL; Value: 10 kOhms; ComponentLink1Description: Datasheet; ComponentLink1URL: https://www.yageo.com/upload/media/product/productsearch/datasheet/rchip/PYu-RC_Group_51_RoHS_L_11.pdf; ComponentLink2Description: DigiKey Link; ComponentLink2URL: https://www.digikey.com/en/products/detail/yageo/RC0603FR-7W10KL/12698809; Composition: Thick Film; Device Package: 0603 (1608 Metric); Features: Moisture Resistant; Height - Seated (Max): 0.022" (0.55mm); LastUpdated: 2022-09-19 1:20:23 PM; Lifecycle Status: Active; Minimum Order: 1; Number of Terminations: 2; Operating Temperature: -55°C ~ 155°C; Package / Case: 0603 (1608 Metric); Packaging: CutTape; PartId: 67088; Part Status: Active; Price: 0.01; Resistance: 10 kOhms; Series: RC_L; Size / Dimension: 0.063" L x 0.031" W (1.60mm x 0.80mm); Supplier 1: DigiKey; Supplier Part Number 1: 13-RC0603FR-7W10KLCT-ND; Supplier Device Package: 0603; Tolerance: ±1%
S1 S2 = 1977223-9: SWITCH TACTILE SPST-NO 0.05A 24V; Manufacturer: TE Connectivity ALCOSWITCH Switches; Actuator Height off PCB, Vertical: 5.00mm; Actuator Orientation: Top Actuated; Actuator Type: Standard; Contact Rating @ Voltage: 0.05A @ 24VDC; Illumination: Non-Illuminated; Operating Force: 160gf; Outline: 6.00mm x 6.00mm; Switch Function: Off-Mom; Part Number: 1977223-9; Circuit: SPST-NO; ComponentLink1Description: Datasheet; ComponentLink1URL: https://www.te.com/commerce/DocumentDelivery/DDEController?Action=srchrtrv&DocNm=1308111-1_SWITCHES_CORE_PROGRAM_CATALOG&DocType=CS&DocLang=English; ComponentLink2Description: DigiKey Link; ComponentLink2URL: http://digikey.com/product-detail/en/te-connectivity-alcoswitch-switches/1977223-9/1977223-9-ND/5597033; LastUpdated: 2020-08-30 9:06:45 PM; Lifecycle Status: Active; Minimum Order: 30000; Mounting Type: Surface Mount; Packaging: Bulk; Price: 0.16; Series: FSMJSMA; Supplier 1: DigiKey; Supplier Part Number 1: 1977223-9-ND; Termination Style: Gull Wing
TP3-TP6 = CMP-00053-4: Conn Test Point 1 POS Solder ST SMD 1 Port T/R; Body Material: Brass; Plating: Tin; Packaging: Cut Tape; Series: S2751, EZ BoardWare; Material: Copper Alloy; Color: Natural; Mount: Surface Mount
U2 = CMP-0511-00012-1: Single-Chip USB to UART Bridge, 1024 Bytes EEPROM, -40 to 85 degC, 28-pin QFN, Tube; Manufacturer: Silicon Labs; Internal Oscillator: TRUE; Sub-Family: USB Bridges; ComponentLink3Description: Package Specification; PackageDescription: 28-Pin Quad-Flat No-Leads Package, Body 5 x 5 mm, Pitch 0.5 mm; PartNumber: CP2102-GM; EEPROM: 1024 Bytes; Mounting Technology: Surface Mount; ComponentLink2URL: http://www.silabs.com/Support%20Documents/TechnicalDocs/CP2102-9.pdf; DatasheetVersion: Rev. 1.5; ComponentLink1URL: http://www.silabs.com/; ComponentLink2Description: Datasheet; Code_JEDEC: MO-220; PackageReference: QFN-28; Code_IPC: J-STD-020C; ComponentLink3URL: http://www.silabs.com/Support%20Documents/TechnicalDocs/C8051T61x.pdf; ComponentLink1Description: Manufacturer URL

## Sheet Input Connections.SchDoc
size 420 x 297 mm; SheetNumber: 6; SheetTotal: 6
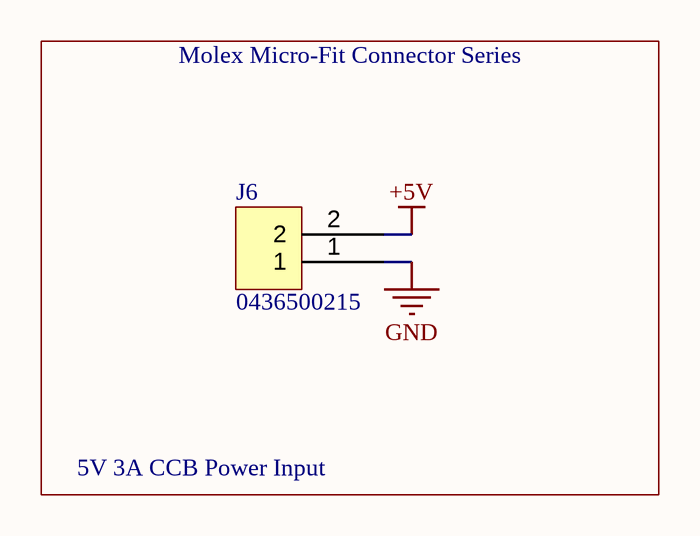
[diagram p3: Input Connections.SchDoc]

### Parts
J6  0436500215  [0436500215-Footprint-1]

### Nets
+5V: J6.2
GND: J6.1

### Notes on the sheet
- Molex Micro-Fit Connector Series
- 5V 3A CCB Power Input
- THIS DOCUMENT AND THE DATA DISCLOSED HEREIN OR
- HEREWITH IS THE PROPERTY OF ALTIUM LIMITED AND MAY
- DWG NO:
- REVISION
- REV:
- DESCRIPTION
- DATE
- APPROVED
- BE FREELY DISTRIBUTED IN WHOLE. NO RIGHTS ARE
- RESERVED OR EXPRESS OR IMPLIED WARANTEE GIVEN.
- ENG:
- APPROVALS
- PROJECT
- DSN:
- CHK:
- REFERENCE DOCUMENTS
- PROJECT REVISION:
- TITLE
- DOCUMENT REVISION:
- DESIGN ITEM:
- BOM:
- FAB DWG:
- PCB DWG:
- ASSY DWG:
- SCALE:
- A3
- SIZE
- CAGE CODE
- FILE NAME
- DWG NO.
- SHEET
- OF
- REV

### Library data of the parts
J6 = CMP-00008-2: Header 1 Row Vertical Polarizing Peg 2 Pin SMT/Glow Wire Compatible Tin Plate; Number of Positions: 2; Max Voltage Rating (DC): 250V; Number of Ports: 1; Pitch: 3mm; Contact Resistance: 30mR; Connector Type: Male Pin; Mount: Through Hole; Depth: 5.57mm; Series: Micro-Fit 3.0™ 43650; Housing Material: Polymer; Max Operating Temperature: 105°C; Fastening Type: Ramp; Color: Black; Length: 9.65mm; Contact Plating: Tin; Number of Rows: 1; Housing Color: Black; RoHS Compliant: Yes; Orientation: Straight; Packaging: Tray; Number of Contacts: 2; Termination: Solder; Contact Material: Brass; Max Voltage Rating (AC): 250V; Min Operating Temperature: -40°C; Number of Terminals/Pins: 2; Contact Type: Male Pin